# Altium schematic sheet 0011_BLNAK.SchDoc
size 848 x 558 mm
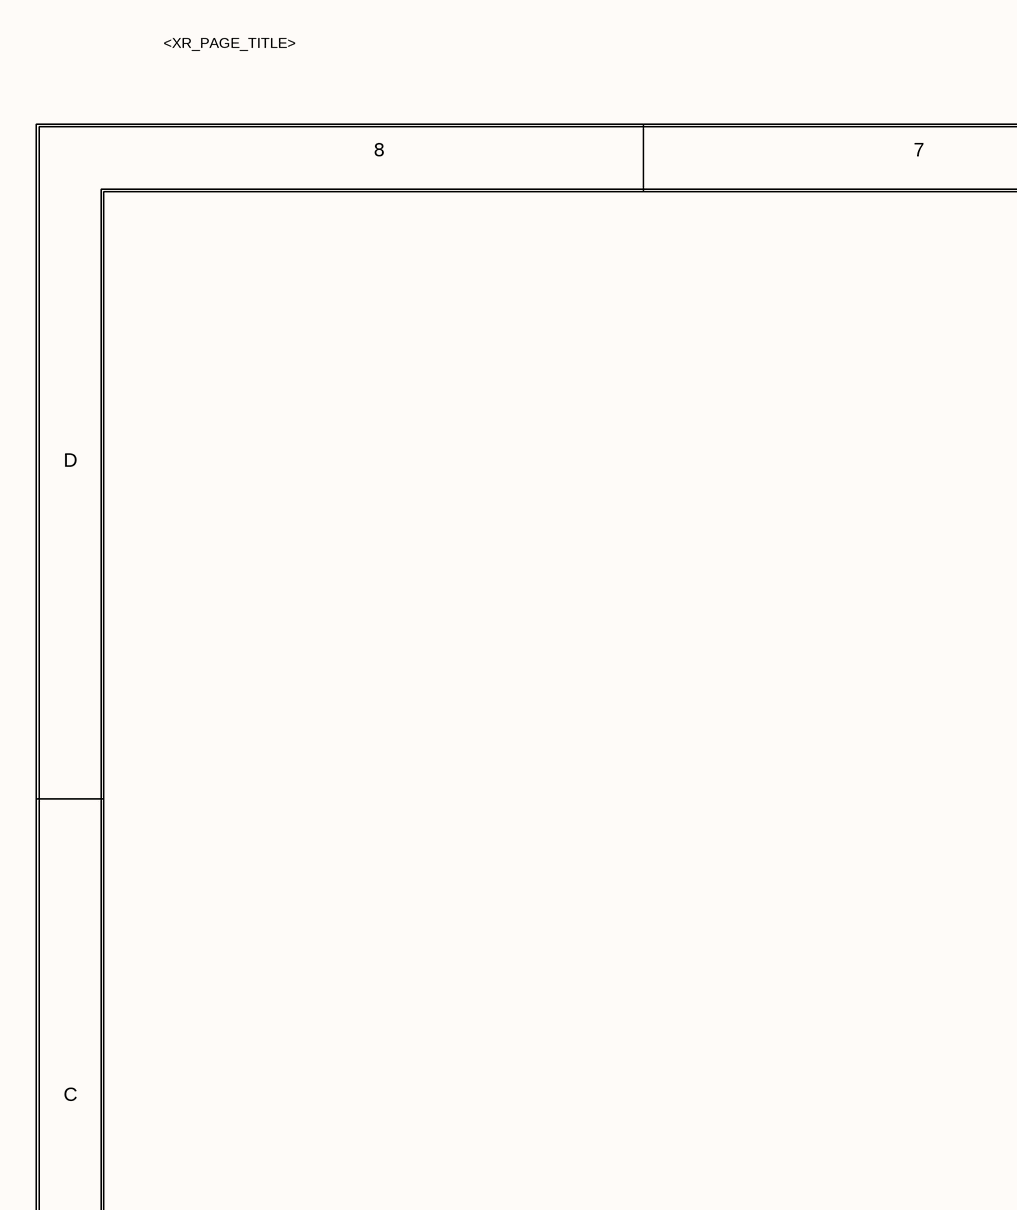
[diagram p0: 0011_BLNAK.SchDoc, top left]
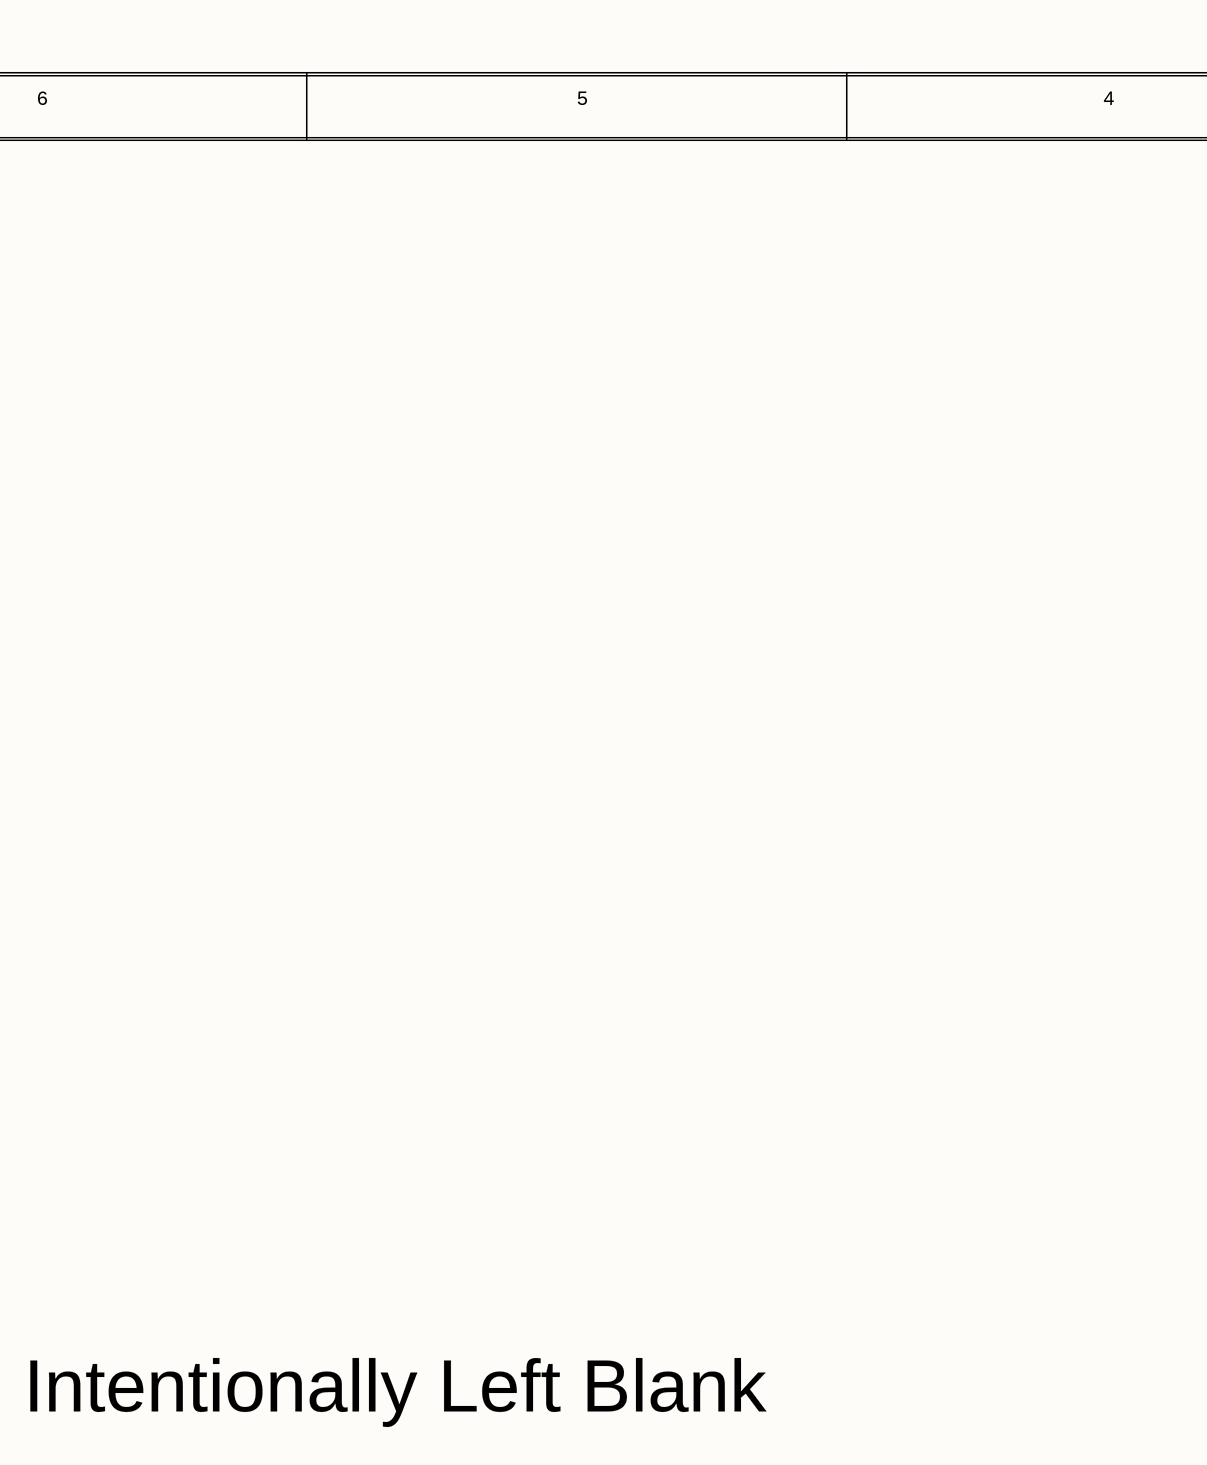
[diagram p1: 0011_BLNAK.SchDoc, top middle]
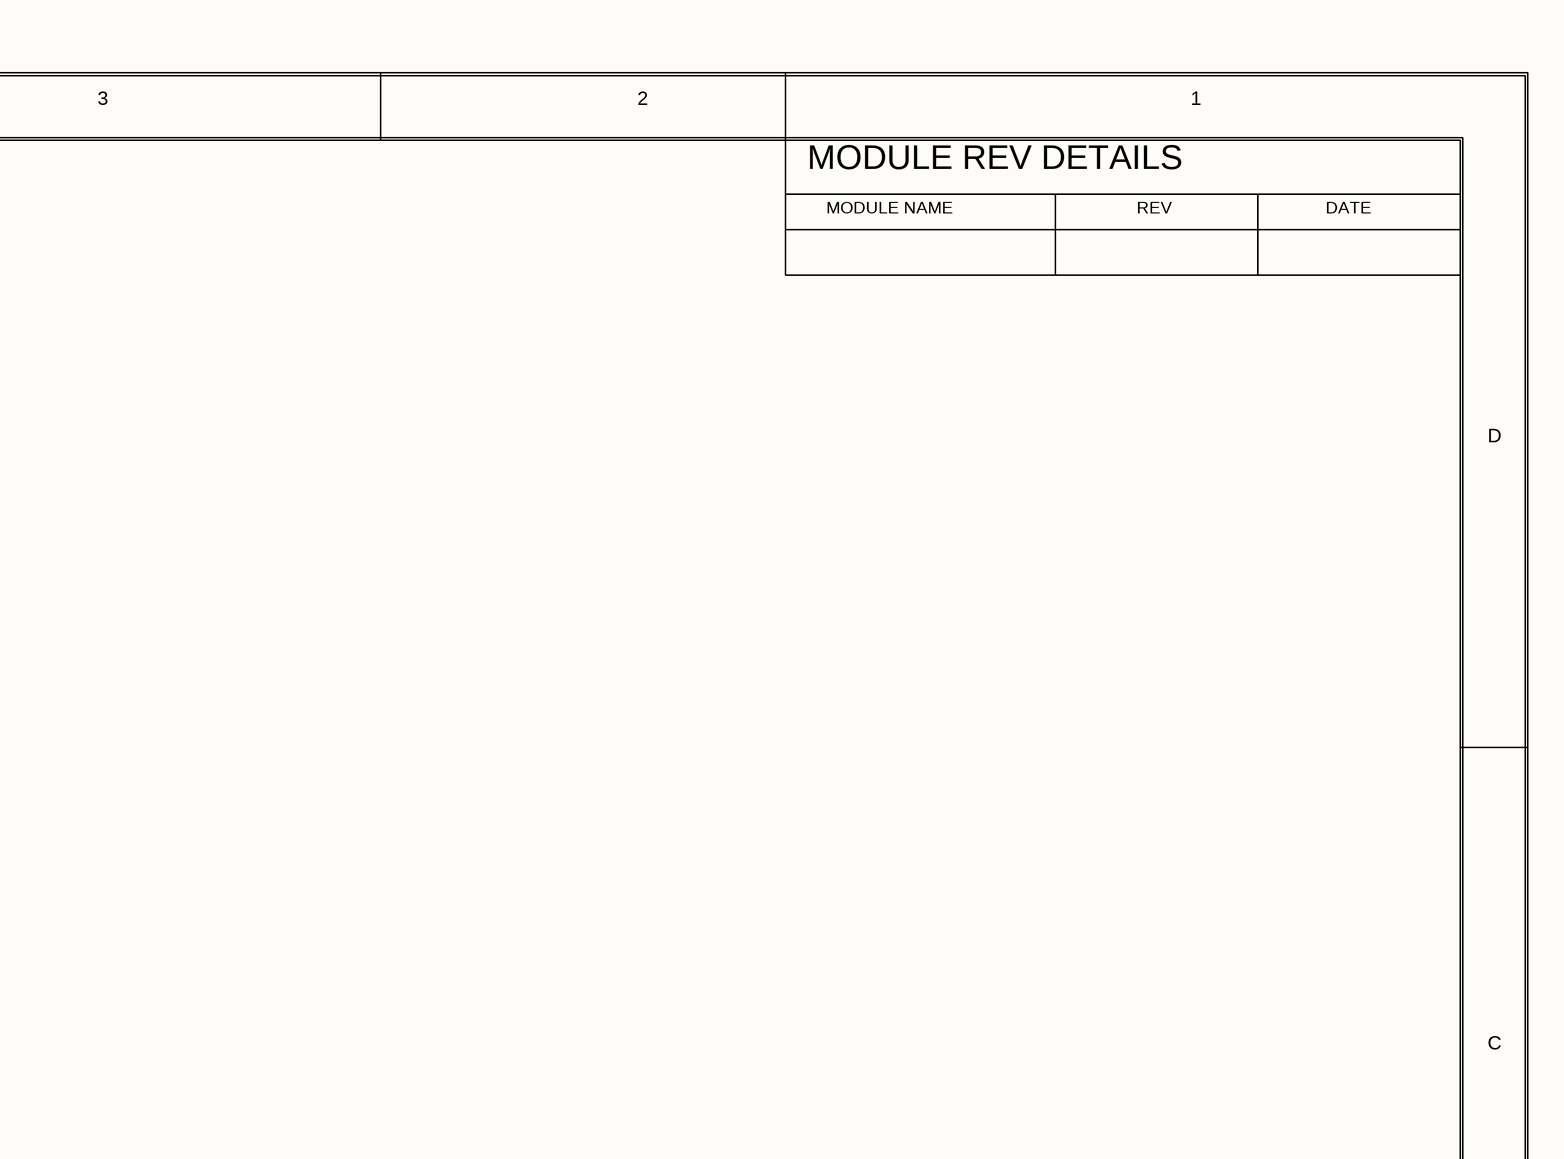
[diagram p2: 0011_BLNAK.SchDoc, top right]
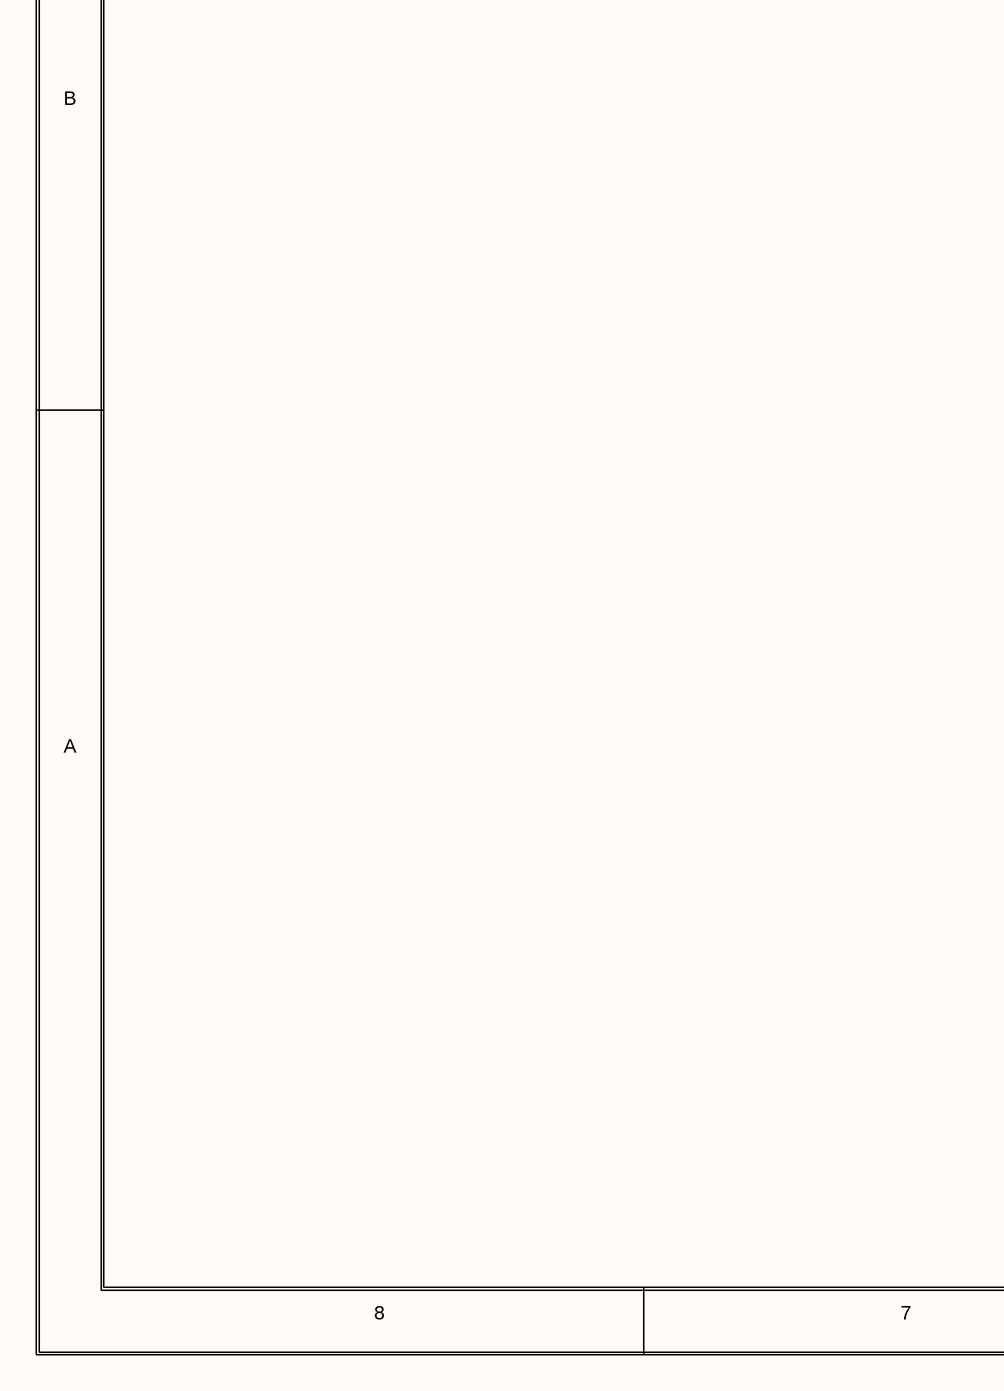
[diagram p3: 0011_BLNAK.SchDoc, bottom left]
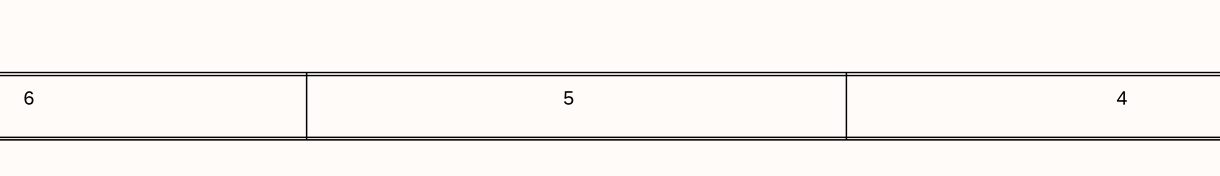
[diagram p4: 0011_BLNAK.SchDoc, bottom middle]
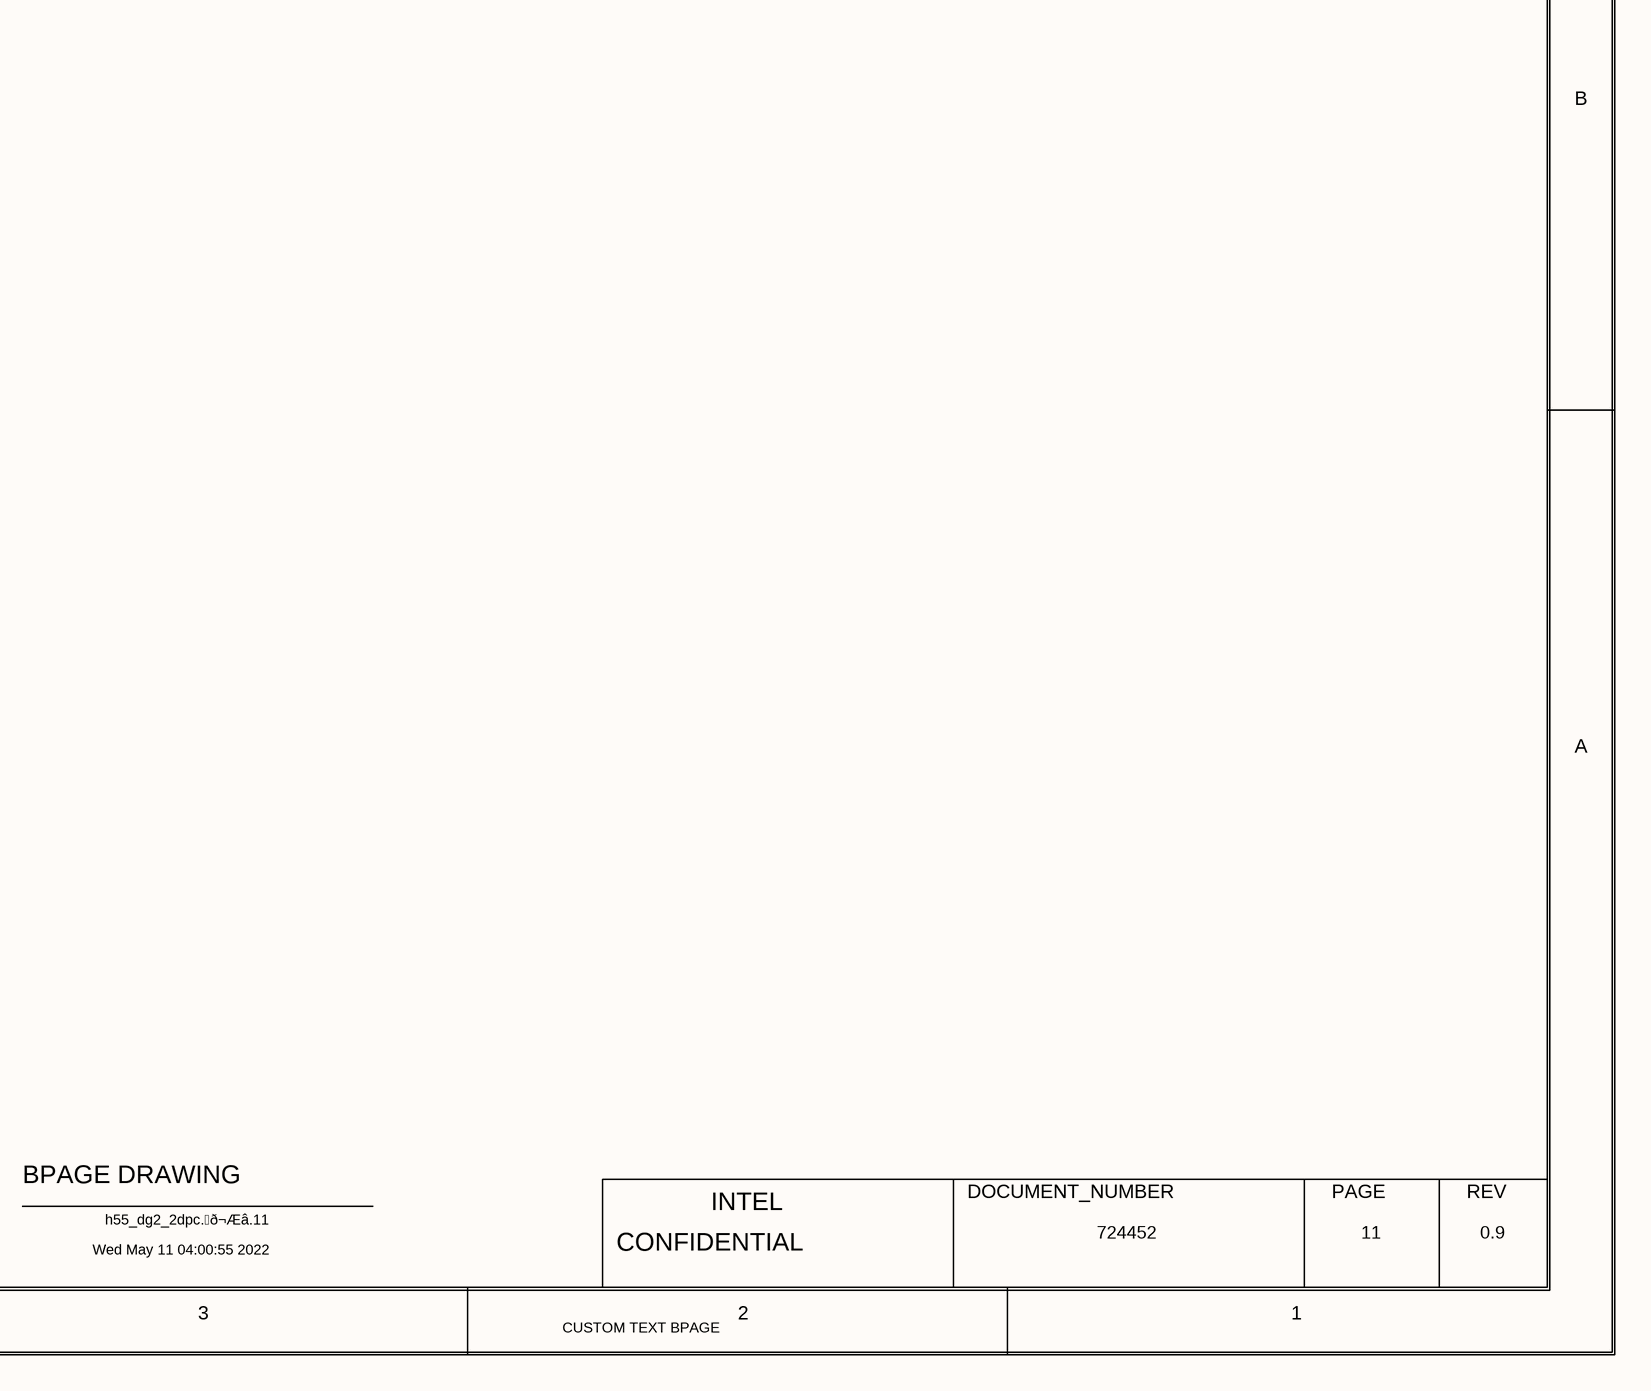
[diagram p5: 0011_BLNAK.SchDoc, bottom right]

## Notes on the sheet
- <XR_PAGE_TITLE>
- 8
- 7
- 6
- 5
- 4
- 3
- 2
- 1
- MODULE REV DETAILS
- MODULE NAME
- REV
- DATE
- D
- C
- Intentionally Left Blank
- B
- A
- BPAGE DRAWING
- INTEL
- DOCUMENT_NUMBER
- PAGE
- Wed May 11 04:00:55 2022
- h55_dg2_2dpc.ð¬Æâ.11
- CONFIDENTIAL
- 724452
- 11
- 0.9
- CUSTOM TEXT BPAGE